# EAGLE design tricorder-featherwing-mk-1.7 (EAGLE 7.5.0)
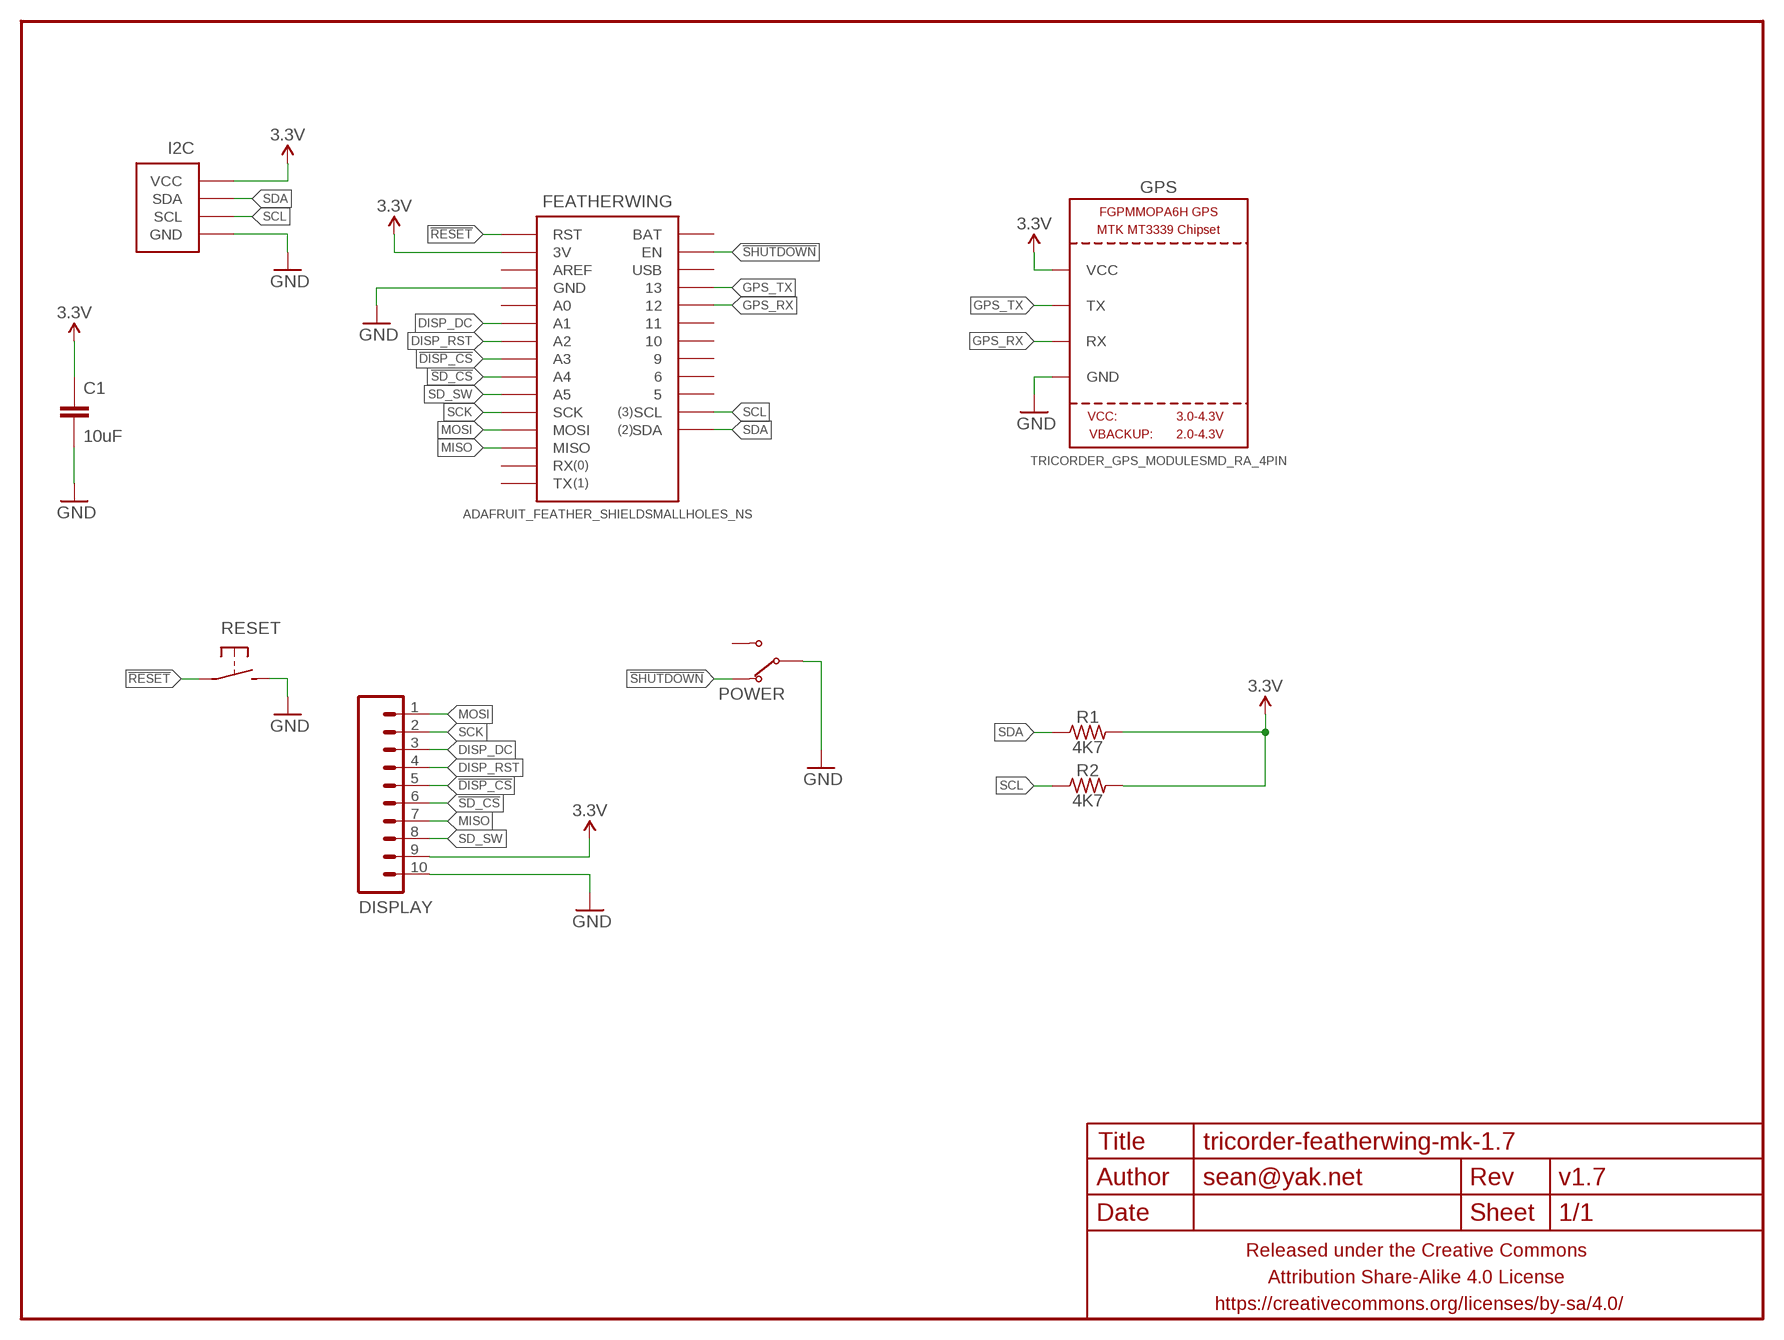
[diagram p0: schematic, sheet 1]

## Parts
C1  10uF  CAPACITOR-CERAMICC1210  [C1210]
DISPLAY  M102MM  [1X10-2MM]
FEATHERWING  ADAFRUIT_FEATHER_SHIELDSMALLHOLES_NS  [ADAFRUIT_FEATHER_SMALLHOLES_NS]
FRAME1  FRAME-LETTERNO_PACKAGE  [DUMMY]
GPS  TRICORDER_GPS_MODULESMD_RA_4PIN  [TRICORDER_GPS_MODULE_RA_CONN_SMD_4PIN]
I2C  M04-I2CPTH-2MM-CENTERED  [1X04-2MM-CENTERED-I2C]
POWER  SWITCH-SPDTPTH-RA-2.54MM-CENTERED  [SPDT-RA-2.54MM-CENTERED]
R1  4K7  RESISTORR0603  [R0603]
R2  4K7  RESISTORR0603  [R0603]
RESET  SPST-NO-TACTCK-PTS840-GK  [TACTILE-SMD-CK-PTS840-GK]

## Nets
3.3V: C1.1 DISPLAY.9 FEATHERWING.3V GPS.VCC I2C.2(VCC) R1.2 R2.2
!DISP_CS: DISPLAY.5 FEATHERWING.A3
!RESET: FEATHERWING.RST RESET.1 RESET.2
!SD_CS: DISPLAY.6 FEATHERWING.A4
!SHUTDOWN: FEATHERWING.EN POWER.1(NC)
DISP_DC: DISPLAY.3 FEATHERWING.A1
DISP_RST: DISPLAY.4 FEATHERWING.A2
GND: C1.2 DISPLAY.10 FEATHERWING.GND@0(GND) FEATHERWING.GND@1(GND) GPS.GND I2C.1(GND) POWER.2(COM) RESET.3 RESET.4
GPS_RX: FEATHERWING.12 GPS.RX
GPS_TX: FEATHERWING.13 GPS.TX
MISO: DISPLAY.7 FEATHERWING.MISO
MOSI: DISPLAY.1 FEATHERWING.MOSI
SCK: DISPLAY.2 FEATHERWING.SCK
SCL: FEATHERWING.SCL I2C.4(SCL) R2.1
SD_SW: DISPLAY.8 FEATHERWING.A5
SDA: FEATHERWING.SDA I2C.3(SDA) R1.1
Unconnected: FEATHERWING.5 FEATHERWING.6 FEATHERWING.9 FEATHERWING.10 FEATHERWING.11 FEATHERWING.A0 FEATHERWING.AREF FEATHERWING.BAT FEATHERWING.RX FEATHERWING.TX FEATHERWING.USB POWER.3(NO)

## Library data of the parts
C1 = a_parts:CAPACITOR-CERAMIC: CAPACITOR, European symbol
DISPLAY = a_parts:M10: Header 10 Standard 10-pin 0.1" header. Use with straight break away headers (SKU : PRT-00116), right angle break away headers (PRT-00553), swiss pins (PRT-00743), machine pins (PRT-00117), and female headers (PRT-00115).
FEATHERWING = a_parts:ADAFRUIT_FEATHER_SHIELD
FRAME1 = a_parts:FRAME-LETTER: Schematic Frame Standard 8.5x11 US Letter frame; DESIGNER: sean@yak.net; VERSION: v1.7
GPS = a_parts:TRICORDER_GPS_MODULE
I2C = a_parts:M04-I2C
POWER = a_parts:SWITCH-SPDT
R1 R2 = a_parts:RESISTOR: RESISTOR, American symbol
RESET = a_parts:SPST-NO-TACT

## Board
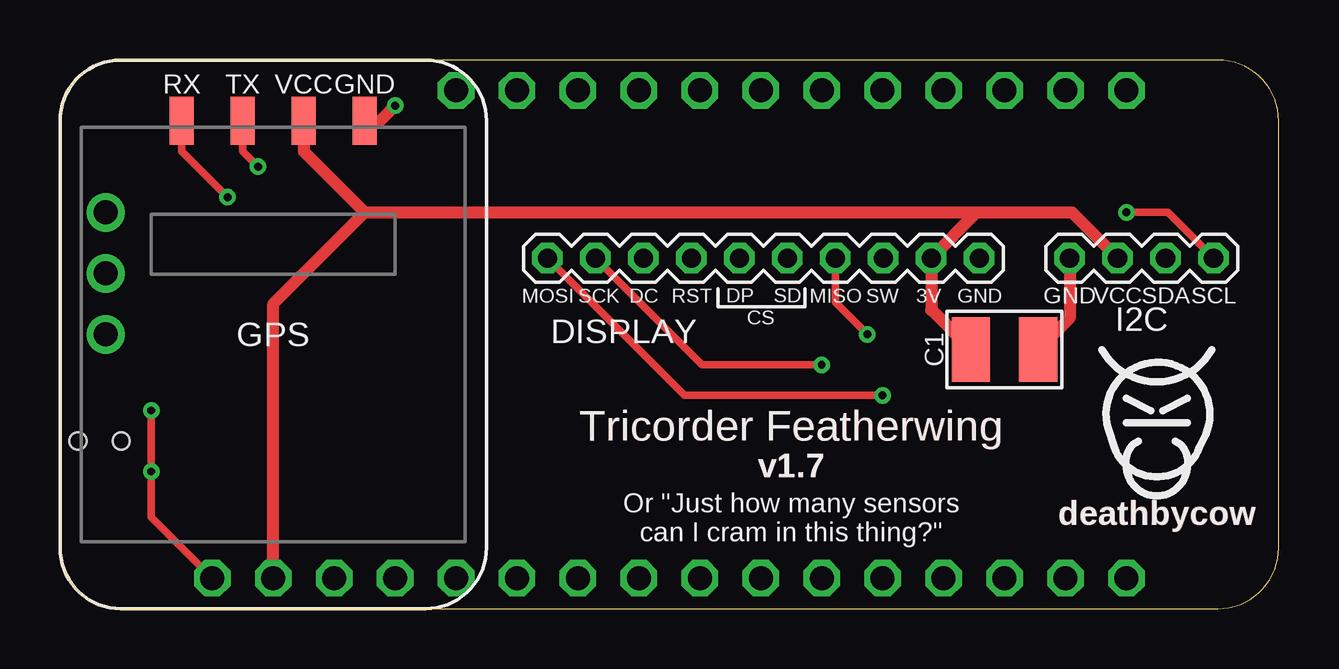
[diagram p1: board, top side]
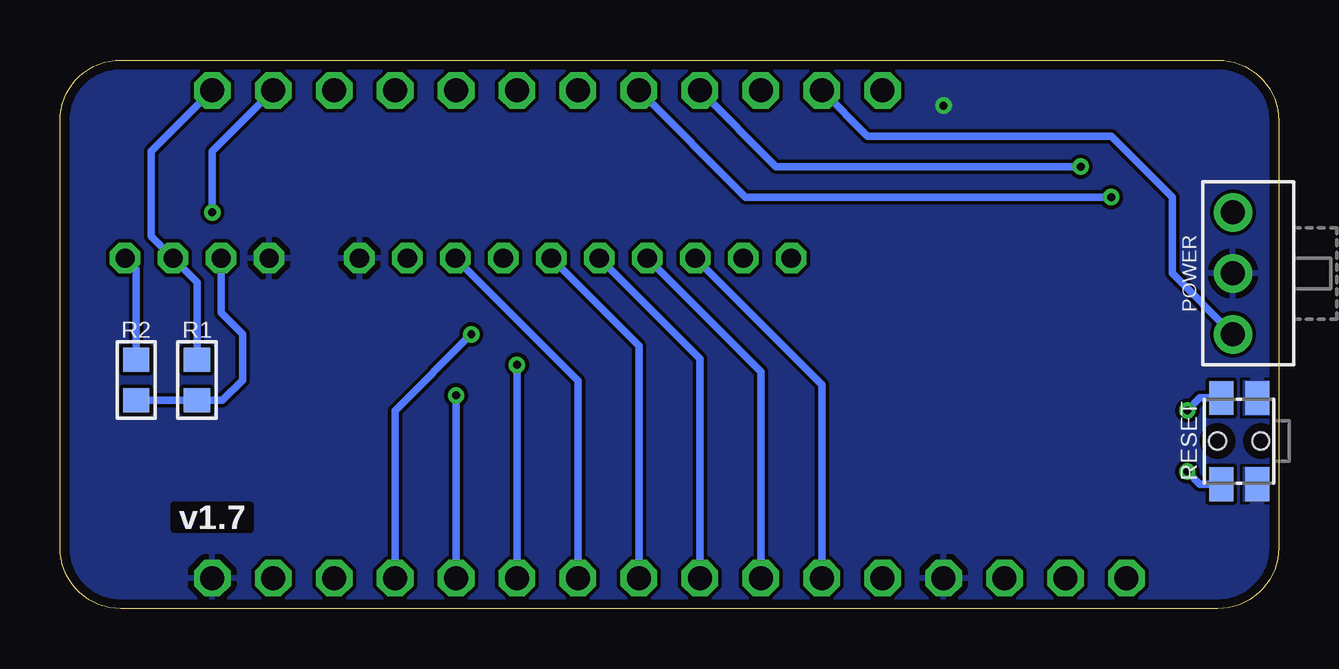
[diagram p2: board, bottom side, seen from below]

Size 50.8 x 22.86 mm. Coordinates in mm from the lower left corner, seen from the top.
Outline: 2.54,0 48.26,0 arc90 50.8,2.54 50.8,20.32 arc90 48.26,22.86 2.54,22.86 arc90 0,20.32 0,2.54 arc90 2.54,0
Copper layers (1*16): Top 0.0356mm / dielectric 1.5011mm / Bottom 0.0356mm
Design rules "LaenPCBOrder2": minimum track width 6mil, minimum drill 13mil, track to track 6mil, track to pad 6mil, pad to pad 6mil, via to via 6mil, smd to smd 6mil, copper to edge 15mil, drill to drill 6mil, minimum pad ring 7mil, minimum via ring 7mil, stop-mask expansion 3mil, vias tented up to drill 20mil, thermal gap 10mil

### Footprints (pad centres in the part's own frame; a part is rotated, then mirrored left to right if it is on the bottom)
C1210 = smd 1.6 x 2.7: 1 -1.4,0; 2 1.4,0
1X10-2MM = drill 0.8 pad 1.27 octagon: 1 0,0; 2 2,0; 3 4,0; 4 6,0; 5 8,0; 6 10,0; 7 12,0; 8 14,0; 9 16,0; 10 18,0
ADAFRUIT_FEATHER_SMALLHOLES_NS = drill 1 pad 1.524 octagon: 3V -16.51,-10.16; 5 13.97,10.16; 6 11.43,10.16; 9 8.89,10.16; 10 6.35,10.16; 11 3.81,10.16; 12 1.27,10.16; 13 -1.27,10.16; A0 -8.89,-10.16; A1 -6.35,-10.16; A2 -3.81,-10.16; A3 -1.27,-10.16; A4 1.27,-10.16; A5 3.81,-10.16; AREF -13.97,-10.16; BAT -8.89,10.16; EN -6.35,10.16; GND@0 -11.43,-10.16; GND@1 19.05,-10.16; MISO 11.43,-10.16; MOSI 8.89,-10.16; RST -19.05,-10.16; RX 13.97,-10.16; SCK 6.35,-10.16; SCL 16.51,10.16; SDA 19.05,10.16; TX 16.51,-10.16; USB -3.81,10.16
TRICORDER_GPS_MODULE_RA_CONN_SMD_4PIN = smd 1 x 2: GND 3.81,8.89; RX -3.81,8.89; TX -1.27,8.89; VCC 1.27,8.89
1X04-2MM-CENTERED-I2C = drill 0.8 pad 1.27 octagon: 1 -3,0; 2 -1,0; 3 1,0; 4 3,0
SPDT-RA-2.54MM-CENTERED = drill 1 pad 1.6: 1 -2.54,0; 2 0,0; 3 2.54,0
R0603 = smd 1 x 1.1: 1 -0.85,0; 2 0.85,0
TACTILE-SMD-CK-PTS840-GK = smd 1.4 x 1: 1 -1.8,0.75; 2 1.8,0.75; 3 -1.8,-0.75; 4 1.8,-0.75 | hole 0.7: 0,-0.9; 0,0.9

### Placement (x,y rotation side)
C1  39.37,10.79 0 top
DISPLAY  20.32,14.61 0 top
FEATHERWING  25.4,11.43 0 top
FRAME1  0,0 0 top
GPS  8.89,11.43 0 top
I2C  45.09,14.61 0 top
POWER  1.91,13.97 90 bottom
R1  45.09,9.53 270 bottom
R2  47.62,9.53 270 bottom
RESET  1.65,6.99 90 bottom
U$2  [COW_SMALL_METAL]  45.72,8.26 0 top

### Tracks (layer width: path | path; a pad name or v marks a point on that pad's centre or on a via)
3.3V
  Top 0.508: 12.7,16.51 38.23,16.51 | GPS.VCC 10.16,19.05 12.7,16.51 | FEATHERWING.3V 8.89,12.7 12.7,16.51 | C1.1 36.32,12.45 DISPLAY.9 38.23,16.51 | 38.23,16.51 42.18,16.51 I2C.2
  Bottom 0.305: I2C.2 44.09,12.34 43.18,11.43 43.18,9.53 44.03,8.68 R1.2 R2.2
!DISP_CS
  Bottom 0.305: FEATHERWING.A3 24.13,10.41 DISPLAY.5
!RESET  (via drill 0.33)
  Top 0.305: v3.81,8.26 v3.81,5.71 3.81,3.81 FEATHERWING.RST
  Bottom 0.305: RESET.2 3.28,8.79 v3.81,8.26 | v3.81,5.71 3.28,5.18 RESET.1
!SD_CS
  Bottom 0.305: FEATHERWING.A4 26.67,10.96 DISPLAY.6
!SHUTDOWN
  Bottom 0.305: FEATHERWING.EN 17.14,19.68 6.99,19.68 4.45,17.14 4.45,13.97 POWER.1
DISP_DC
  Bottom 0.305: FEATHERWING.A1 19.05,9.34 DISPLAY.3
DISP_RST
  Bottom 0.305: FEATHERWING.A2 21.59,9.88 DISPLAY.4
GND  (via drill 0.33)
  Top 0.508: GPS.GND 13.34,20.32 v13.97,20.95 | I2C.1 42.09,12.11 C1.2
  pour Bottom: 2.54,0 48.26,0 arc90 50.8,2.54 50.8,20.32 arc90 48.26,22.86 2.54,22.86 arc90 0,20.32 0,2.54 arc90
GPS_RX  (via drill 0.33)
  Top 0.305: GPS.RX 5.08,19.05 v6.99,17.14
  Bottom 0.305: v6.99,17.14 22.23,17.14 FEATHERWING.12
GPS_TX  (via drill 0.33)
  Top 0.305: GPS.TX 7.62,19.05 v8.26,18.41
  Bottom 0.305: v8.26,18.41 20.95,18.41 FEATHERWING.13
MISO  (via drill 0.33)
  Top 0.305: v33.66,11.43 32.32,12.77 DISPLAY.7
  Bottom 0.305: FEATHERWING.MISO 36.83,8.26 v33.66,11.43
MOSI  (via drill 0.33)
  Top 0.305: v34.29,8.89 26.04,8.89 DISPLAY.1
  Bottom 0.305: FEATHERWING.MOSI v34.29,8.89
SCK  (via drill 0.33)
  Top 0.305: v31.75,10.16 26.77,10.16 DISPLAY.2
  Bottom 0.305: FEATHERWING.SCK v31.75,10.16
SCL  (via drill 0.33)
  Top 0.305: v44.45,16.51 46.18,16.51 I2C.4
  Bottom 0.305: FEATHERWING.SCL 44.45,19.05 v44.45,16.51 | R2.1 47.62,14.14 I2C.4
SD_SW
  Bottom 0.305: FEATHERWING.A5 29.21,9.49 DISPLAY.8
SDA
  Bottom 0.305: FEATHERWING.SDA 46.99,19.05 46.99,15.51 I2C.3 45.09,13.61 R1.1

### Text on the board
Top: Tricorder Featherwing
tPlace: MOSI | SCK | DC | RST | DP | SD | MISO | SW | 3V | GND | CS | Tricorder Featherwing | Or "Just how many sensors / can I cram in this thing?"